# Altium schematic sheet AfternoonCape_RevA3_6chan.SchDoc
size A2
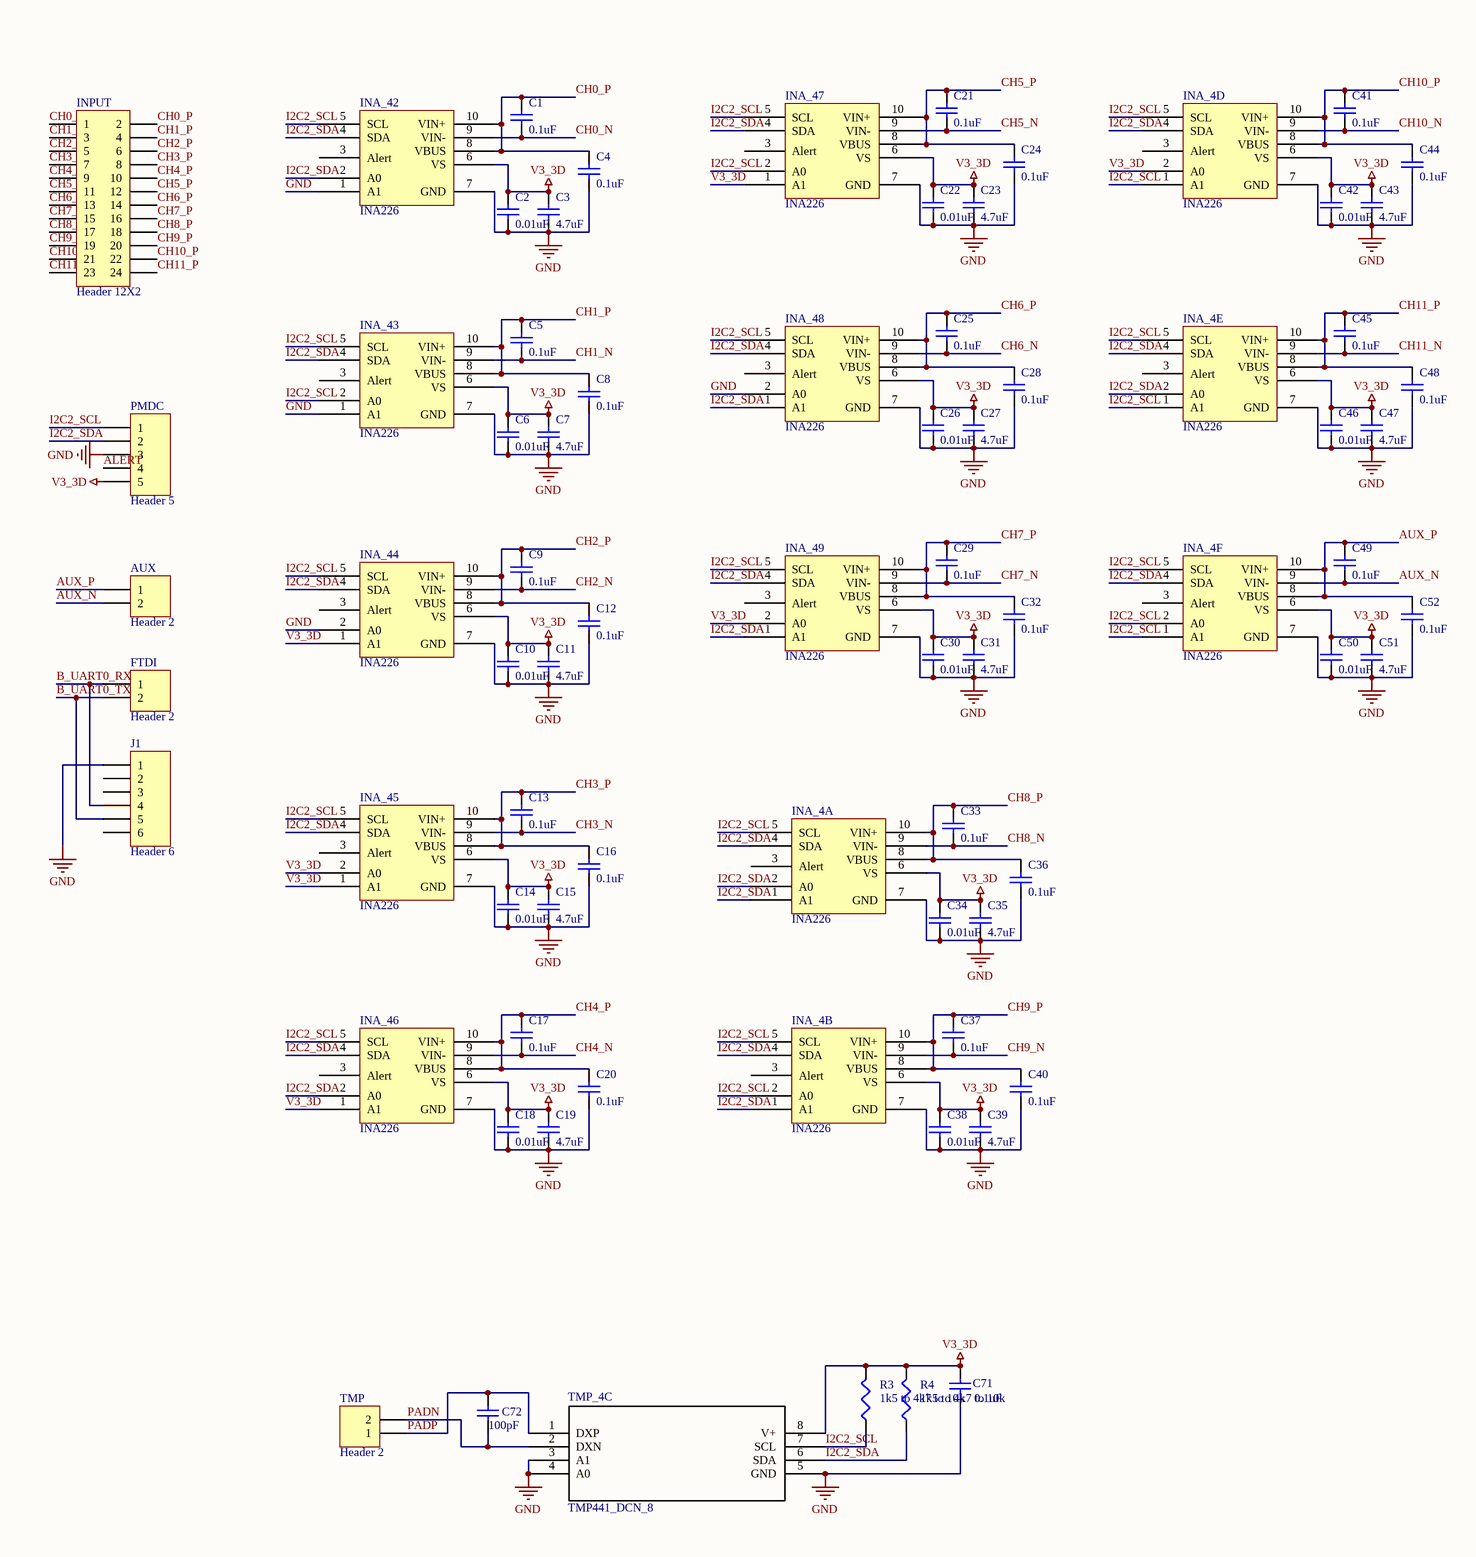
[diagram p0: AfternoonCape_RevA3_6chan.SchDoc, left]
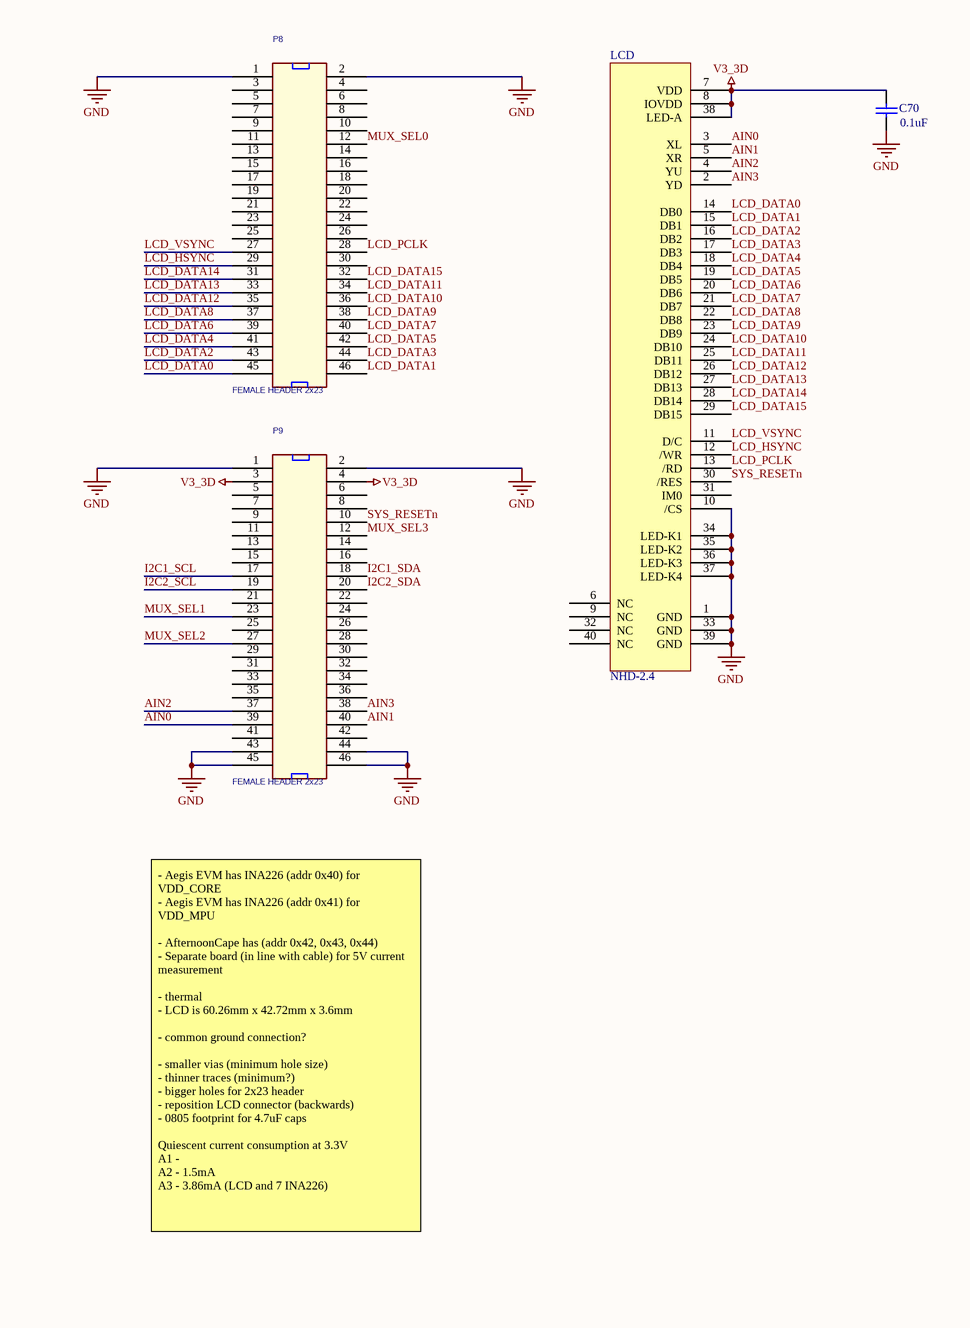
[diagram p1: AfternoonCape_RevA3_6chan.SchDoc, right]

## Parts
AUX  Header 2  [HDR1X2]
C1  value 0.1uF  [0402]  (hidden comment: Cap Semi)
C2  value 0.01uF  [0402]  (hidden comment: Cap Semi)
C3  value 4.7uF  [0402]  (hidden comment: Cap Semi)
C4  value 0.1uF  [0402]  (hidden comment: Cap Semi)
C5  value 0.1uF  [0402]  (hidden comment: Cap Semi)
C6  value 0.01uF  [0402]  (hidden comment: Cap Semi)
C7  value 4.7uF  [0402]  (hidden comment: Cap Semi)
C8  value 0.1uF  [0402]  (hidden comment: Cap Semi)
C9  value 0.1uF  [0402]  (hidden comment: Cap Semi)
C10  value 0.01uF  [0402]  (hidden comment: Cap Semi)
C11  value 4.7uF  [0402]  (hidden comment: Cap Semi)
C12  value 0.1uF  [0402]  (hidden comment: Cap Semi)
C13  value 0.1uF  [0402]  (hidden comment: Cap Semi)
C14  value 0.01uF  [0402]  (hidden comment: Cap Semi)
C15  value 4.7uF  [0402]  (hidden comment: Cap Semi)
C16  value 0.1uF  [0402]  (hidden comment: Cap Semi)
C17  value 0.1uF  [0402]  (hidden comment: Cap Semi)
C18  value 0.01uF  [0402]  (hidden comment: Cap Semi)
C19  value 4.7uF  [0402]  (hidden comment: Cap Semi)
C20  value 0.1uF  [0402]  (hidden comment: Cap Semi)
C21  value 0.1uF  [0402]  (hidden comment: Cap Semi)
C22  value 0.01uF  [0402]  (hidden comment: Cap Semi)
C23  value 4.7uF  [0402]  (hidden comment: Cap Semi)
C24  value 0.1uF  [0402]  (hidden comment: Cap Semi)
C25  value 0.1uF  [0402]  (hidden comment: Cap Semi)
C26  value 0.01uF  [0402]  (hidden comment: Cap Semi)
C27  value 4.7uF  [0402]  (hidden comment: Cap Semi)
C28  value 0.1uF  [0402]  (hidden comment: Cap Semi)
C29  value 0.1uF  [0402]  (hidden comment: Cap Semi)
C30  value 0.01uF  [0402]  (hidden comment: Cap Semi)
C31  value 4.7uF  [0402]  (hidden comment: Cap Semi)
C32  value 0.1uF  [0402]  (hidden comment: Cap Semi)
C33  value 0.1uF  [0402]  (hidden comment: Cap Semi)
C34  value 0.01uF  [0402]  (hidden comment: Cap Semi)
C35  value 4.7uF  [0402]  (hidden comment: Cap Semi)
C36  value 0.1uF  [0402]  (hidden comment: Cap Semi)
C37  value 0.1uF  [0402]  (hidden comment: Cap Semi)
C38  value 0.01uF  [0402]  (hidden comment: Cap Semi)
C39  value 4.7uF  [0402]  (hidden comment: Cap Semi)
C40  value 0.1uF  [0402]  (hidden comment: Cap Semi)
C41  value 0.1uF  [0402]  (hidden comment: Cap Semi)
C42  value 0.01uF  [0402]  (hidden comment: Cap Semi)
C43  value 4.7uF  [0402]  (hidden comment: Cap Semi)
C44  value 0.1uF  [0402]  (hidden comment: Cap Semi)
C45  value 0.1uF  [0402]  (hidden comment: Cap Semi)
C46  value 0.01uF  [0402]  (hidden comment: Cap Semi)
C47  value 4.7uF  [0402]  (hidden comment: Cap Semi)
C48  value 0.1uF  [0402]  (hidden comment: Cap Semi)
C49  value 0.1uF  [0402]  (hidden comment: Cap Semi)
C50  value 0.01uF  [0402]  (hidden comment: Cap Semi)
C51  value 4.7uF  [0402]  (hidden comment: Cap Semi)
C52  value 0.1uF  [0402]  (hidden comment: Cap Semi)
C70  value 0.1uF  [0402]  (hidden comment: Cap Semi)
C71  value 0.1uF  [0402]  (hidden comment: Cap Semi)
C72  value 100pF  [0402]  (hidden comment: Cap Semi)
FTDI  Header 2  [HDR1X2]
INA_4A  INA226  [DGS10]
INA_4B  INA226  [DGS10]
INA_4D  INA226  [DGS10]
INA_4E  INA226  [DGS10]
INA_4F  INA226  [DGS10]
INA_42  INA226  [DGS10]
INA_43  INA226  [DGS10]
INA_44  INA226  [DGS10]
INA_45  INA226  [DGS10]
INA_46  INA226  [DGS10]
INA_47  INA226  [DGS10]
INA_48  INA226  [DGS10]
INA_49  INA226  [DGS10]
INPUT  Header 12X2  [HDR2X12]
J1  Header 6  [HDR1X6]
LCD  NHD-2.4  [NHD-2.4]
P8  FEMALE HEADER 2x23  [HEADER23X2]
P9  FEMALE HEADER 2x23  [HEADER23X2]
PMDC  Header 5  [HDR1X5]
R3  value 1k5 to 4k7 to 10k  [0402]  (hidden comment: Res3)
R4  value 1k5 to 4k7 to 10k  [0402]  (hidden comment: Res3)
TMP  Header 2  [HDR1X2]
TMP_4C  TMP441_DCN_8  [DCN8-L]

## Nets
GND: C2.1 C3.1 C4.1 C6.1 C7.1 C8.1 C10.1 C11.1 C12.1 C14.1 C15.1 C16.1 C18.1 C19.1 C20.1 C22.1 C23.1 C24.1 C26.1 C27.1 C28.1 C30.1 C31.1 C32.1 C34.1 C35.1 C36.1 C38.1 C39.1 C40.1 C42.1 C43.1 C44.1 C46.1 C47.1 C48.1 C50.1 C51.1 C52.1 C70.1 C71.1 INA_4A.7(GND) INA_4B.7(GND) INA_4D.7(GND) INA_4E.7(GND) INA_4F.7(GND) INA_42.1(A1) INA_42.7(GND) INA_43.1(A1) INA_43.7(GND) INA_44.2(A0) INA_44.7(GND) INA_45.7(GND) INA_46.7(GND) INA_47.7(GND) INA_48.2(A0) INA_48.7(GND) INA_49.7(GND) J1.1 LCD.1(GND) LCD.10(/CS) LCD.33(GND) LCD.34(LED-K1) LCD.35(LED-K2) LCD.36(LED-K3) LCD.37(LED-K4) LCD.39(GND) P8.1 P8.2 P9.1 P9.2 P9.43 P9.44 P9.45 P9.46 PMDC.3 TMP_4C.3(A1) TMP_4C.4(A0) TMP_4C.5(GND)
V3_3D: C2.2 C3.2 C6.2 C7.2 C10.2 C11.2 C14.2 C15.2 C18.2 C19.2 C22.2 C23.2 C26.2 C27.2 C30.2 C31.2 C34.2 C35.2 C38.2 C39.2 C42.2 C43.2 C46.2 C47.2 C50.2 C51.2 C70.2 C71.2 INA_4A.6(VS) INA_4B.6(VS) INA_4D.2(A0) INA_4D.6(VS) INA_4E.6(VS) INA_4F.6(VS) INA_42.6(VS) INA_43.6(VS) INA_44.1(A1) INA_44.6(VS) INA_45.1(A1) INA_45.2(A0) INA_45.6(VS) INA_46.1(A1) INA_46.6(VS) INA_47.1(A1) INA_47.6(VS) INA_48.6(VS) INA_49.2(A0) INA_49.6(VS) LCD.7(VDD) LCD.8(IOVDD) LCD.38(LED-A) P9.3 P9.4 PMDC.5 R3.2 R4.2 TMP_4C.8(V+)
AIN0: LCD.3(XL) P9.39
AIN1: LCD.5(XR) P9.40
AIN2: LCD.4(YU) P9.37
AIN3: LCD.2(YD) P9.38
ALERT: PMDC.4
AUX_N: AUX.2 C49.1 INA_4F.9(VIN-)
AUX_P: AUX.1 C49.2 C52.2 INA_4F.8(VBUS) INA_4F.10(VIN+)
B_UART0_RX: FTDI.1 J1.4
B_UART0_TX: FTDI.2 J1.5
CH0_N: C1.1 INA_42.9(VIN-) INPUT.1
CH0_P: C1.2 C4.2 INA_42.8(VBUS) INA_42.10(VIN+) INPUT.2
CH1_N: C5.1 INA_43.9(VIN-) INPUT.3
CH1_P: C5.2 C8.2 INA_43.8(VBUS) INA_43.10(VIN+) INPUT.4
CH2_N: C9.1 INA_44.9(VIN-) INPUT.5
CH2_P: C9.2 C12.2 INA_44.8(VBUS) INA_44.10(VIN+) INPUT.6
CH3_N: C13.1 INA_45.9(VIN-) INPUT.7
CH3_P: C13.2 C16.2 INA_45.8(VBUS) INA_45.10(VIN+) INPUT.8
CH4_N: C17.1 INA_46.9(VIN-) INPUT.9
CH4_P: C17.2 C20.2 INA_46.8(VBUS) INA_46.10(VIN+) INPUT.10
CH5_N: C21.1 INA_47.9(VIN-) INPUT.11
CH5_P: C21.2 C24.2 INA_47.8(VBUS) INA_47.10(VIN+) INPUT.12
CH6_N: C25.1 INA_48.9(VIN-) INPUT.13
CH6_P: C25.2 C28.2 INA_48.8(VBUS) INA_48.10(VIN+) INPUT.14
CH7_N: C29.1 INA_49.9(VIN-) INPUT.15
CH7_P: C29.2 C32.2 INA_49.8(VBUS) INA_49.10(VIN+) INPUT.16
CH8_N: C33.1 INA_4A.9(VIN-) INPUT.17
CH8_P: C33.2 C36.2 INA_4A.8(VBUS) INA_4A.10(VIN+) INPUT.18
CH9_N: C37.1 INA_4B.9(VIN-) INPUT.19
CH9_P: C37.2 C40.2 INA_4B.8(VBUS) INA_4B.10(VIN+) INPUT.20
CH10_N: C41.1 INA_4D.9(VIN-) INPUT.21
CH10_P: C41.2 C44.2 INA_4D.8(VBUS) INA_4D.10(VIN+) INPUT.22
CH11_N: C45.1 INA_4E.9(VIN-) INPUT.23
CH11_P: C45.2 C48.2 INA_4E.8(VBUS) INA_4E.10(VIN+) INPUT.24
I2C1_SCL: P9.17
I2C1_SDA: P9.18
I2C2_SCL: INA_4A.5(SCL) INA_4B.2(A0) INA_4B.5(SCL) INA_4D.1(A1) INA_4D.5(SCL) INA_4E.1(A1) INA_4E.5(SCL) INA_4F.1(A1) INA_4F.2(A0) INA_4F.5(SCL) INA_42.5(SCL) INA_43.2(A0) INA_43.5(SCL) INA_44.5(SCL) INA_45.5(SCL) INA_46.5(SCL) INA_47.2(A0) INA_47.5(SCL) INA_48.5(SCL) INA_49.5(SCL) P9.19 PMDC.1 R3.1 TMP_4C.7(SCL)
I2C2_SDA: INA_4A.1(A1) INA_4A.2(A0) INA_4A.4(SDA) INA_4B.1(A1) INA_4B.4(SDA) INA_4D.4(SDA) INA_4E.2(A0) INA_4E.4(SDA) INA_4F.4(SDA) INA_42.2(A0) INA_42.4(SDA) INA_43.4(SDA) INA_44.4(SDA) INA_45.4(SDA) INA_46.2(A0) INA_46.4(SDA) INA_47.4(SDA) INA_48.1(A1) INA_48.4(SDA) INA_49.1(A1) INA_49.4(SDA) P9.20 PMDC.2 R4.1 TMP_4C.6(SDA)
LCD_DATA0: LCD.14(DB0) P8.45
LCD_DATA1: LCD.15(DB1) P8.46
LCD_DATA2: LCD.16(DB2) P8.43
LCD_DATA3: LCD.17(DB3) P8.44
LCD_DATA4: LCD.18(DB4) P8.41
LCD_DATA5: LCD.19(DB5) P8.42
LCD_DATA6: LCD.20(DB6) P8.39
LCD_DATA7: LCD.21(DB7) P8.40
LCD_DATA8: LCD.22(DB8) P8.37
LCD_DATA9: LCD.23(DB9) P8.38
LCD_DATA10: LCD.24(DB10) P8.36
LCD_DATA11: LCD.25(DB11) P8.34
LCD_DATA12: LCD.26(DB12) P8.35
LCD_DATA13: LCD.27(DB13) P8.33
LCD_DATA14: LCD.28(DB14) P8.31
LCD_DATA15: LCD.29(DB15) P8.32
LCD_HSYNC: LCD.12(/WR) P8.29
LCD_PCLK: LCD.13(/RD) P8.28
LCD_VSYNC: LCD.11(D/C) P8.27
MUX_SEL0: P8.12
MUX_SEL1: P9.23
MUX_SEL2: P9.27
MUX_SEL3: P9.12
PADN: C72.1 TMP.2 TMP_4C.2(DXN)
PADP: C72.2 TMP.1 TMP_4C.1(DXP)
SYS_RESETn: LCD.30(/RES) P9.10

Not connected (* = marked no-connect by the designer): INA_4A 3(Alert); INA_4B 3(Alert); INA_4D 3(Alert); INA_4E 3(Alert); INA_4F 3(Alert); INA_42 3(Alert); INA_43 3(Alert); INA_44 3(Alert); INA_45 3(Alert); INA_46 3(Alert); INA_47 3(Alert); INA_48 3(Alert); INA_49 3(Alert); J1 2 3 6; LCD 6(NC) 9(NC) 31(IM0) 32(NC) 40(NC); P8 3(2) 4(27) 5(3) 6(28) 7(4) 8(29) 9(5) 10(30) 11(6) 13(7) 14(32) 15(8) 16(33) 17(9) 18(34) 19(10) 20(35) 21(11) 22(36) 23(12) 24(37) 25(13) 26(38) 30(40); P9 5(3) 6(28) 7(4) 8(29) 9(5) 11(6) 13(7) 14(32) 15(8) 16(33) 21(11) 22(36) 24(37) 25(13) 26(38) 28(39) 29(15) 30(40) 31(16) 32(41) 33(17) 34(42) 35(18) 36(43) 41(21) 42(46)

## Notes on the sheet
- - Aegis EVM has INA226 (addr 0x40) for VDD_CORE
  - Aegis EVM has INA226 (addr 0x41) for VDD_MPU
  - AfternoonCape has (addr 0x42, 0x43, 0x44)
  - Separate board (in line with cable) for 5V current measurement
  - thermal
  - LCD is 60.26mm x 42.72mm x 3.6mm
  - common ground connection?
  - smaller vias (minimum hole size)
  - thinner traces (minimum?)
  - bigger holes for 2x23 header
  - reposition LCD connector (backwards)
  - 0805 footprint for 4.7uF caps
  Quiescent current consumption at 3.3V
  A1 -
  A2 - 1.5mA
  A3 - 3.86mA (LCD and 7 INA226)
- Title
- Size:
- Date:
- File:
- A2
- Number:
- Time:
- Revision:
- Sheet
- of

## Library data of the parts
AUX FTDI TMP = Header 2: Header, 2-Pin; LatestRevisionDate: 17-Jul-2002; LatestRevisionNote: Re-released for DXP Platform.; Publisher: Altium Limited
C1-C52 C70-C72 = Cap Semi: Capacitor (Semiconductor SIM Model); Published: 8-Jun-2000; LatestRevisionDate: 29-May-2009; LatestRevisionNote: IPC-7351 Footprint Added.; PackageReference: C1206; Publisher: Altium Limited; PackageDescription: Chip Capacitor
INPUT = Header 12X2: Header, 12-Pin, Dual row; LatestRevisionDate: 17-Jul-2002; LatestRevisionNote: Re-released for DXP Platform.; Publisher: Altium Limited
J1 = Header 6: 6-pin female header, long legs for FTDI-USB cable; LatestRevisionDate: 17-Jul-2002; LatestRevisionNote: Re-released for DXP Platform.; Publisher: Altium Limited
LCD = NHD-2.4: 2.4" LCD NHD-2.4-240320SF-CTXL#-FTN1 54132-4062 Molex LCD Connector Footprint
P8 P9 = HDR_46_F_2_0.1_0.1: CONN HEADER FMAL 46PS.1" DL GOLD; Manufacturer: Sullins Connector Solutions; Manufacturer Part Number: PPPC232LFBN-RC; Number of Positions: 46; Number of Positions Loaded: All; Pitch: 0.100" (2.54mm); Supplier 1: Digi-Key; Supplier Part Number 1: S7126-ND; RoHS: RoHS Compliant; Category: Connectors, Interconnects; Stock 1: 750; Pricing 1: 1=2.75, 10=2.325, 25=2.2196, 50=2.0084, 100=1.7969, 250=1.58552, 500=1.4798, 1000=1.3741, 2500=1.32125 (USD); Connector Type: Header; Contact Type: Female Socket; Number of Rows: 2; Row Spacing: 0.100" (2.54mm); Mounting Type: Through Hole; Termination: Solder; Fastening Type: -; Features: -; Contact Finish: Gold; Contact Finish Thickness: Flash; Color: Black; Packaging: Bulk; ComponentLink1URL: http://www.sullinscorp.com/drawings/78_P(N)PxCxxxLFBN-RC,_10492-G.pdf; ComponentLink1Description: http://www.sullinscorp.com/drawings/78_P(N)PxCxxxLFBN-RC,_10492-G.pdf
PMDC = Header 5: Header, 5-Pin; LatestRevisionDate: 17-Jul-2002; LatestRevisionNote: Re-released for DXP Platform.; Publisher: Altium Limited
R3 R4 = Res3: Resistor; Published: 8-Jun-2000; LatestRevisionDate: 29-May-2009; LatestRevisionNote: IPC-7351 Footprint Added.; PackageReference: J1-0603; Publisher: Altium Limited; PackageDescription: Chip Resistor
TMP_4C = TMP441_DCN_8: Imported; GENERIC_PART_NUMBER: TMP441; Vendor: Texas Instruments; PACKAGE_DESIGNATOR: DCN; PIN_COUNT: 8; FAMILY_NAME: TEMPERATURE SENSOR; INDUSTRY_STD_PKG_TYPE: SOT-23; Manufacturer_Part_Number: tmp441_dcn_8; Datasheet URL: http://www.ti.com/lit/gpn/TMP441; Manufacturer: Texas Instruments; RefDes: RefDes; Type: DEV; Value: Value